# EAGLE design datalogger (EAGLE 7.6.0)
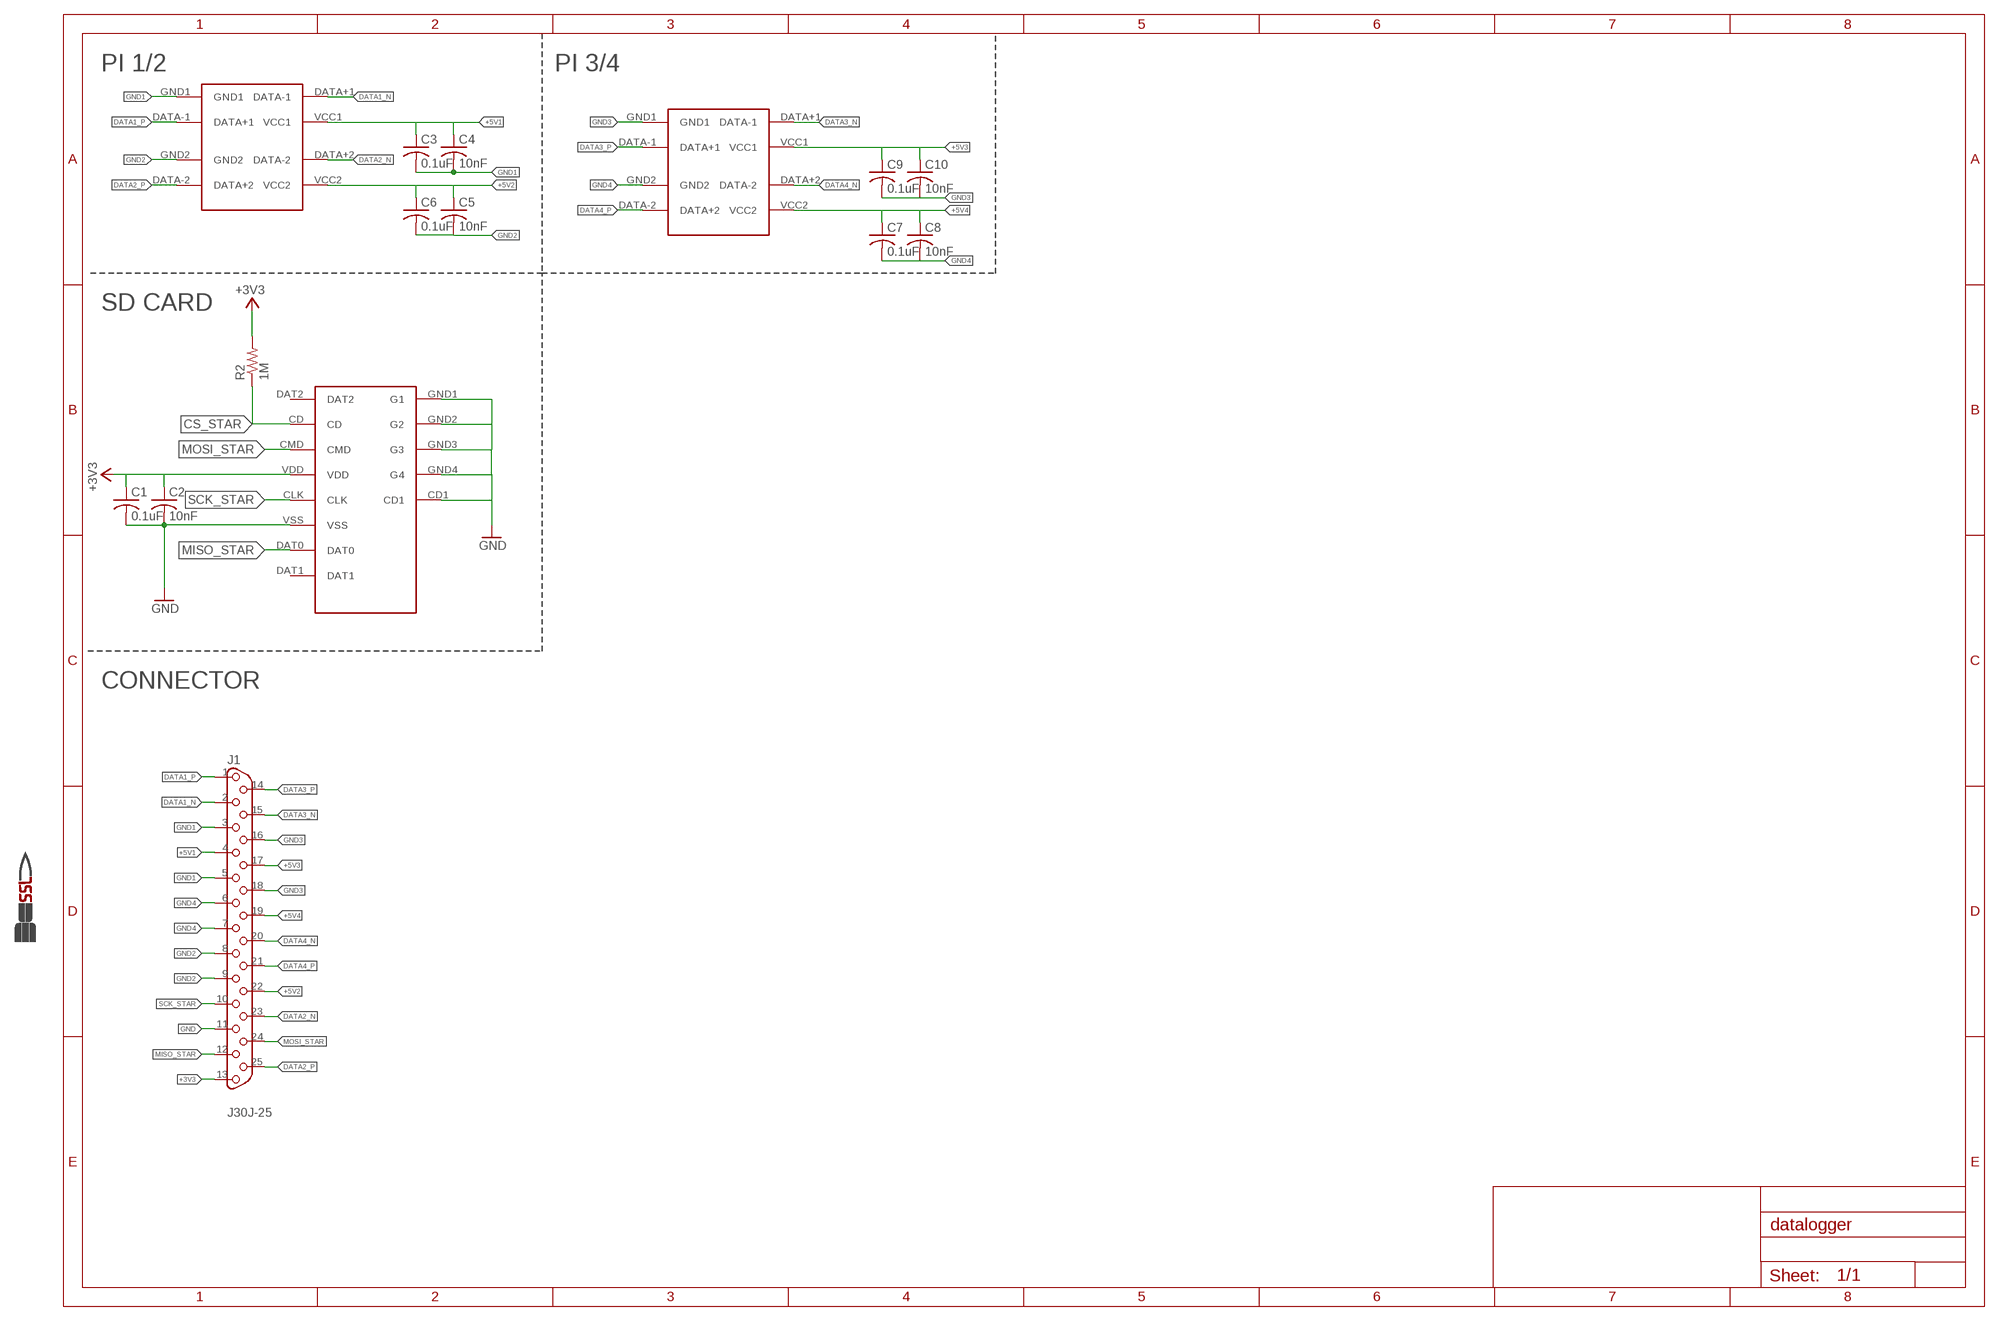
[diagram p0: schematic, sheet 1]

## Parts
C1  0.1uF  C-USC0603  [C0603]
C2  10nF  C-USC0603  [C0603]
C3  0.1uF  C-USC0603  [C0603]
C4  10nF  C-USC0603  [C0603]
C5  10nF  C-USC0603  [C0603]
C6  0.1uF  C-USC0603  [C0603]
C7  0.1uF  C-USC0603  [C0603]
C8  10nF  C-USC0603  [C0603]
C9  0.1uF  C-USC0603  [C0603]
C10  10nF  C-USC0603  [C0603]
GND1  SSL.3IN_SILK  [SSL_SILK_.3IN]
J1  J30J-25  [ZKN-25]
R2  1M  R-US_R0603  [R0603]
U$1  MICRO_SD  [MICRO_SD_HINGED]
U$2  USB_A  [USB_A]
U$3  USB_A  [USB_A]

## Nets
+3V3: C1.1 C2.1 J1.13 R2.2 U$1.VDD
+5V1: C3.1 C4.1 J1.4 U$2.VCC1
+5V2: C5.1 C6.1 J1.22 U$2.VCC2
+5V3: C9.1 C10.1 J1.17 U$3.VCC1
+5V4: C7.1 C8.1 J1.19 U$3.VCC2
CS_STAR: R2.1 U$1.CD
DATA1_N [diff_pair]: J1.2 U$2.DATA+1(DATA-1)
DATA1_P [diff_pair]: J1.1 U$2.DATA-1(DATA+1)
DATA2_N [diff_pair]: J1.23 U$2.DATA+2(DATA-2)
DATA2_P [diff_pair]: J1.25 U$2.DATA-2(DATA+2)
DATA3_N [diff_pair]: J1.15 U$3.DATA+1(DATA-1)
DATA3_P [diff_pair]: J1.14 U$3.DATA-1(DATA+1)
DATA4_N [diff_pair]: J1.20 U$3.DATA+2(DATA-2)
DATA4_P [diff_pair]: J1.21 U$3.DATA-2(DATA+2)
GND: C1.2 C2.2 J1.11 U$1.CD1 U$1.GND1(G1) U$1.GND2(G2) U$1.GND3(G3) U$1.GND4(G4) U$1.VSS
GND1: C3.2 C4.2 J1.3 J1.5 U$2.GND1
GND2: C5.2 C6.2 J1.8 J1.9 U$2.GND2
GND3: C9.2 C10.2 J1.16 J1.18 U$3.GND1
GND4: C7.2 C8.2 J1.6 J1.7 U$3.GND2
MISO_STAR: J1.12 U$1.DAT0
MOSI_STAR: J1.24 U$1.CMD
SCK_STAR: J1.10 U$1.CLK
Unconnected: U$1.DAT1 U$1.DAT2

## Notes on the sheet
- PI 1/2 | PI 3/4
- SD CARD
- CONNECTOR

## Library data of the parts
C1-C10 = resistor:C-US: CAPACITOR, American symbol
GND1 = images:SSL
J1 = CM_J30J:J30J-25
R2 = resistor:R-US_: RESISTOR, American symbol
U$1 = NR_connectors:MICRO_SD
U$2 U$3 = NR_connectors:USB_A

## Net classes
0 default: width 0.406 mm
1 diff_pair: width 0.737 mm

## Board
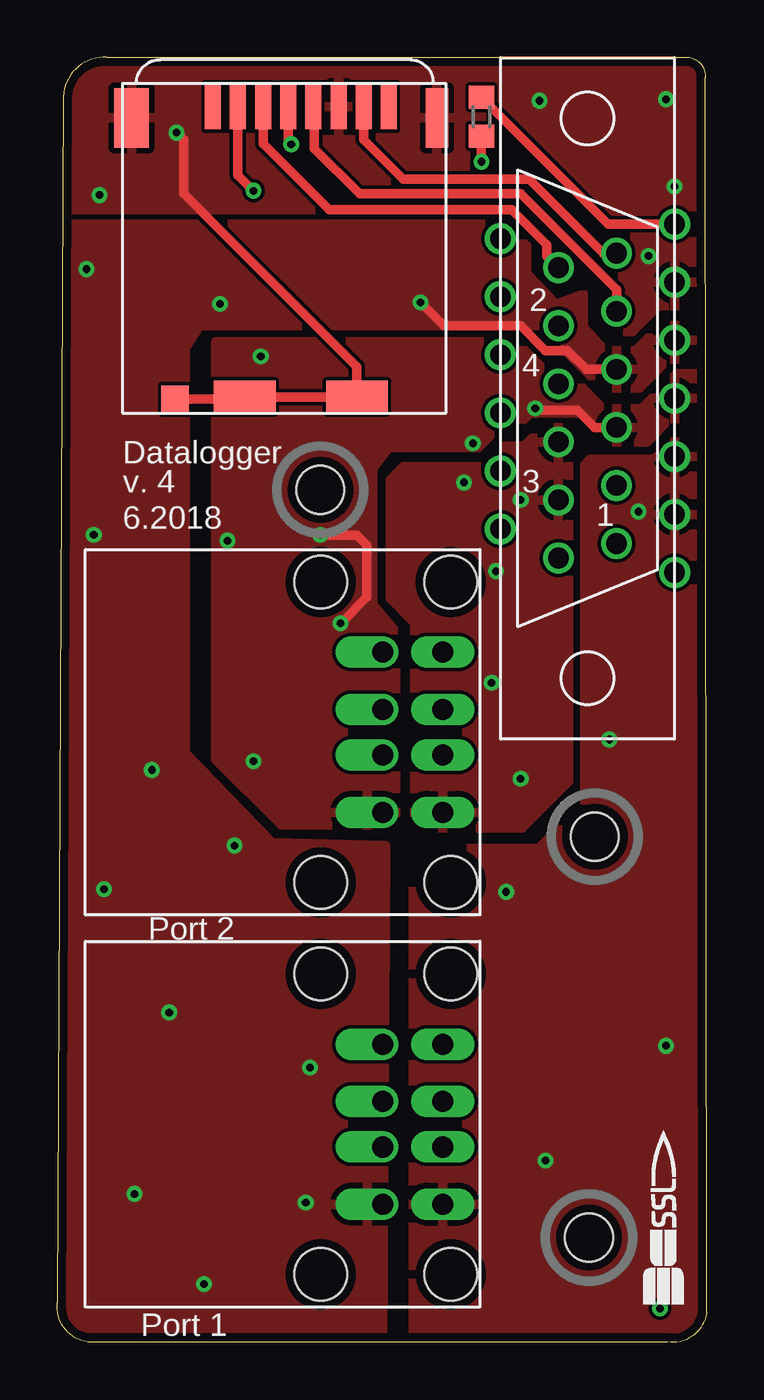
[diagram p1: board, top side]
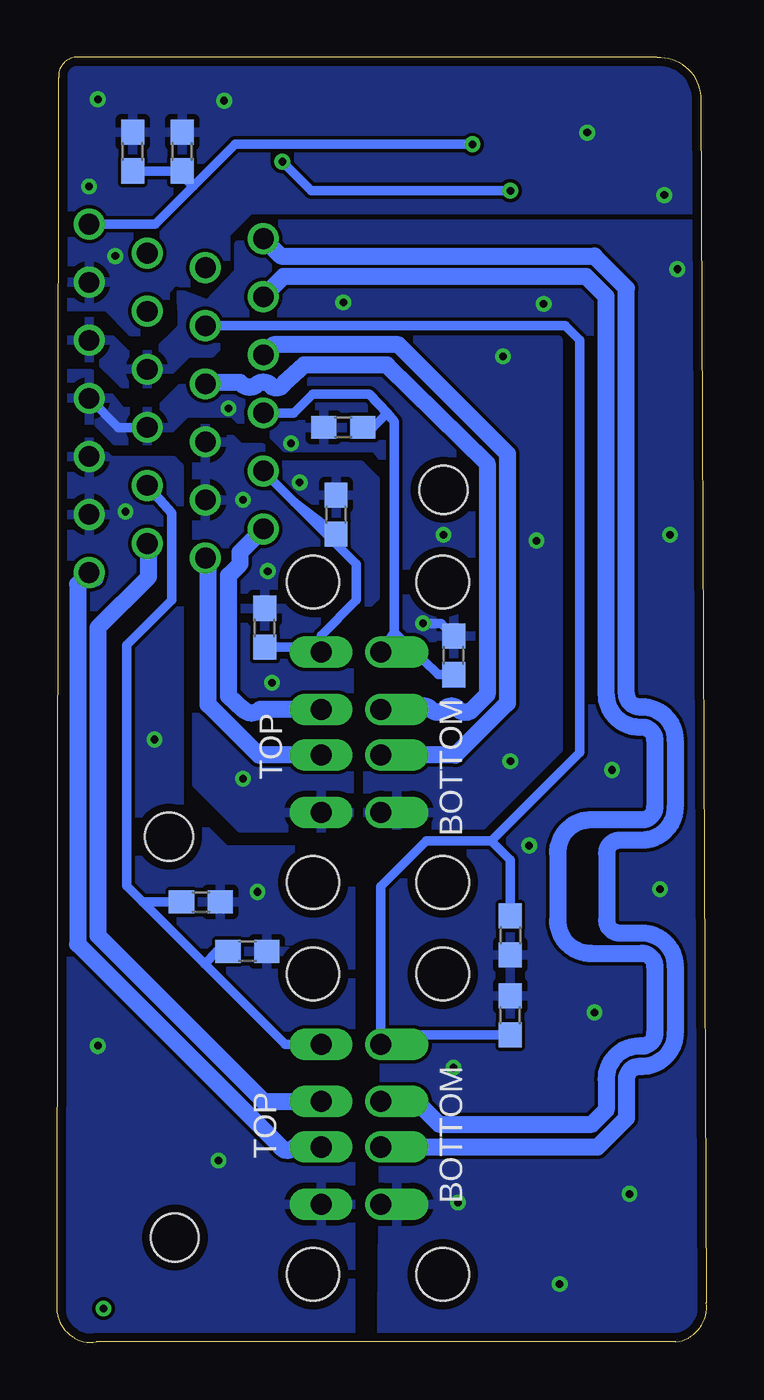
[diagram p2: board, bottom side, seen from below]

Size 28.4 x 56.21 mm. Coordinates in mm from the lower left corner, seen from the top.
Outline: 1.34,0.02 26.68,0.02 arc90 28.4,1.29 28.33,55.32 arc90 27.57,56.21 2.17,56.21 arc90 0.27,54.5 0.01,1.73 arc90 1.34,0.02
Copper layers (1*16): Top 0.0356mm / dielectric 1.5011mm / Bottom 0.0356mm
Design rules "OshPark": minimum track width 6mil, minimum drill 13mil, track to track 6mil, track to pad 6mil, pad to pad 6mil, via to via 6mil, smd to smd 6mil, copper to edge 15mil, drill to drill 6mil, minimum pad ring 7mil, minimum via ring 7mil, stop-mask expansion 3mil, vias tented up to drill 0mil, thermal gap 10mil
Holes 2.1 mm at 23.51,22.11 23.25,4.59 11.5,37.29

### Footprints (pad centres in the part's own frame; a part is rotated, then mirrored left to right if it is on the bottom)
C0603 = smd 1.1 x 1: 1 -0.85,0; 2 0.85,0
ZKN-25 = drill 0.9: 1 -7.62,-3.81; 2 -6.35,-1.27; 3 -5.08,-3.81; 4 -3.81,-1.27; 5 -2.54,-3.81; 6 -1.27,-1.27; 7 0,-3.81; 8 1.27,-1.27; 9 2.54,-3.81; 10 3.81,-1.27; 11 5.08,-3.81; 12 6.35,-1.27; 13 7.62,-3.81; 14 -6.985,1.27; 15 -5.715,3.81; 16 -4.445,1.27; 17 -3.175,3.81; 18 -1.905,1.27; 19 -0.635,3.81; 20 0.635,1.27; 21 1.905,3.81; 22 3.175,1.27; 23 4.445,3.81; 24 5.715,1.27; 25 6.985,3.81
R0603 = smd 1 x 1.1: 1 -0.85,0; 2 0.85,0
MICRO_SD_HINGED = smd 0.7 x 2: CD -1.1,-13.4; CLK -4.4,-13.4; CMD -2.2,-13.4; DAT0 -6.6,-13.4; DAT1 -7.7,-13.4; DAT2 0,-13.4; VDD -3.3,-13.4; VSS -5.5,-13.4 | smd 2.7 x 1.4: CD1 -1.4,-0.7; GND3 -6.3,-0.7 | smd 1.5 x 2.6: GND1 3.55,-12.9 | smd 1.2 x 1.2: GND2 1.65,-0.6 | smd 1 x 2.6: GND4 -9.8,-12.9
USB_A = drill 0.92 long: DATA+1 -1,7.005; DATA-1 1,7.005; GND1 3.5,7.005; VCC1 -3.5,7.005 | drill 0.92 offset: DATA+2 -1,4.385; DATA-2 1,4.385; GND2 3.5,4.385; VCC2 -3.5,4.385 | hole 2.3: -6.57,7.355; -6.57,1.675; 6.57,7.355; 6.57,1.675

### Placement (x,y rotation side)
C1  22.93,52.09 90 bottom
C2  25.09,52.09 90 bottom
C3  22.11,19.26 0 bottom
C4  20.08,17.1 0 bottom
C5  8.58,14.3 90 bottom
C6  8.58,17.8 270 bottom
C7  11.06,30.05 90 bottom
C8  15.89,40.02 180 bottom
C9  19.32,31.26 90 bottom
C10  16.2,36.21 90 bottom
GND1  25.28,1.67 0 top
J1  23.19,41.29 90 top
R2  18.55,53.61 90 top
U$1  6.81,40.66 180 top
U$2  9.85,9.54 270 top
U$3  9.85,26.69 270 top

### Tracks (layer width: path | path; a pad name or v marks a point on that pad's centre or on a via)
+3V3  (via drill 0.33)
  Top 0.406: J1.13 24.1,48.91 R2.2 | U$1.VDD 10.11,52.53 v10.23,52.4
  Bottom 0.406: v10.23,52.4 20.61,52.4 22.44,50.57 | 22.44,50.57 24.1,48.91 J1.13 | 22.44,50.57 22.93,51.07 C1.1 C2.1
+5V1
  Bottom 0.406: U$2.VCC1 18.43,13.04 21.95,16.56 | 21.95,16.56 24.65,19.26 | J1.4 23.38,36.27 23.38,32.46 25.35,30.5 25.35,19.95 24.65,19.26 | C3.1 24.65,19.26 | C4.1 21.41,17.1 21.95,16.56
+5V2
  Bottom 0.406: 9.41,21.92 12.27,21.92 14.24,19.95 U$2.VCC2 13.83,13.45 C5.1 | 9.41,21.92 5.54,25.8 5.54,43.83 6.17,44.47 J1.22 | C6.1 8.58,21.1 9.41,21.92
+5V3
  Bottom 0.406: 18.02,36.76 15.31,34.05 15.31,32.46 16.86,30.92 U$3.VCC1 17.08,30.41 C9.1 | 18.02,36.76 J1.17 | C10.1 18.02,36.76
+5V4
  Bottom 0.406: J1.19 18.04,40.66 17.22,41.48 14.74,41.48 13.97,40.64 | 13.66,31.08 U$3.VCC2 | C8.1 14.59,40.02 13.97,40.64 | 13.66,31.08 11.72,29.2 C7.1 | 13.66,31.08 13.66,40.28 13.97,40.64
CS_STAR  (via drill 0.33)
  Top 0.406: U$1.CD 7.91,51.05 v8.58,50.37 | v18.55,51.64 R2.1
  Bottom 0.406: v8.58,50.37 17.28,50.37 v18.55,51.64
DATA1_N
  Bottom 0.737: U$2.DATA+1 19.37,10.54 26.62,17.79 26.62,31.26 24.39,33.48 24.39,34.88 J1.2
DATA1_P
  Bottom 0.737: 26.74,33.42 J1.1 27.51,33.16 27.51,17.42 18.63,8.54 arc-97 18.04,8.52 16.87,8.52 arc-90 U$2.DATA-1
DATA2_N
  Bottom 0.737: J1.23 18.49,46.62 5.28,46.62 4.39,45.74 4.39,28.36 arc-90 2.94,26.91 2.83,26.91 arc90 2.27,26.35 2.27,23.41 arc90 2.83,22.85 5.07,22.85 arc-90 6.52,21.4 6.52,18.46 arc-90 5.07,17.02 2.83,17.02 arc90 2.27,16.46 2.27,13.52 arc90 2.83,12.96 2.94,12.96 arc-90 4.39,11.51 4.39,10.17 5.02,9.54 11.69,9.54 12.65,10.49 14.19,10.49 U$2.DATA+2
DATA2_P
  Bottom 0.737: U$2.DATA-2 4.76,8.54 3.5,9.8 3.5,11.51 arc90 2.94,12.07 2.83,12.07 arc-90 1.38,13.52 1.38,16.46 arc-90 2.83,17.9 3.81,17.9 arc90 4.37,18.46 4.37,21.4 arc90 3.81,21.96 2.83,21.96 arc-90 1.38,23.41 1.38,26.35 arc-90 2.83,27.8 2.94,27.8 arc90 3.5,28.36 3.5,46.11 4.91,47.51 18.62,47.51 J1.25
DATA3_N
  Bottom 0.737: J1.15 20.39,34.56 20.39,34.05 20.9,33.54 20.9,28.27 20.26,27.69 arc-92 19.51,27.7 16.87,27.7 arc90 U$3.DATA+1
DATA3_P
  Bottom 0.737: U$3.DATA-1 19.58,25.69 21.79,27.9 21.79,34.18 J1.14
DATA4_N
  Bottom 0.737: U$3.DATA+2 arc98 13.22,27.7 arc-96 12.65,27.7 arc96 12.08,27.7 arc-96 11.44,27.7 arc96 10.87,27.7 arc-93 10.24,27.69 9.6,28.33 9.6,38.44 13.97,42.75 17.6,42.75 18.49,41.93 arc86 19,41.8 arc-86 19.63,41.93 arc98 20.39,41.99 21.77,41.99 arc-45 J1.20
DATA4_P
  Bottom 0.737: U$3.DATA-2 10.99,25.69 8.71,27.96 8.71,38.87 13.48,43.64 18.93,43.64 J1.21
GND  (via drill 0.33)
  Top 0.406: v5.22,52.91 5.54,52.59 5.54,50.24 13.11,42.67 U$1.GND3 13.04,41.42 12.9,41.42 12.84,41.36 U$1.CD1 8.11,41.26 U$1.GND2
  other vias: 1.85,50.18 21.09,54.31 26.62,54.37 27,50.56 25.86,47.51
  pour Top (rank 3): 29.09,45.35 26.3,45.35 25.16,44.21 24.01,44.21 23.44,44.78 23.7,45.99 23.25,46.43 22.17,46.05 21.03,47.2 21.03,48.47 19.95,49.55 -0.75,49.55 -0.75,57.23 29.09,57.23
  pour Bottom (rank 3): 26.24,45.29 25.16,44.21 24.01,44.21 23.44,44.78 23.7,45.99 23.25,46.43 22.11,46.05 21.03,47.13 21.03,48.47 19.95,49.55 -2.08,49.55 -2.08,56.4 29.35,56.4 29.35,45.29
GND1  (via drill 0.33)
  other vias: 25.41,36.34 24.14,26.37 19.63,19.7 26.62,12.97 21.35,7.95
  pour Bottom (rank 2): 29.6,39.39 26.87,39.39 26.05,38.56 23.32,38.56 23.06,38.31 23.06,23.57 21.03,21.54 15.57,21.54 15.57,-0.43 29.98,-0.43 29.98,39.39 29.73,39.39
  pour Top (rank 2): 29.22,39.39 26.87,39.39 26.36,38.88 26.11,38.62 23.32,38.62 23.06,38.37 23.06,23.64 21.03,21.61 15.57,21.61 15.57,-1.51 29.22,-1.51
GND2  (via drill 0.33)
  Top 0.406: J1.8 23.12,42.56 22.3,43.39 21.35,43.39 20.27,44.47 16.9,44.47 v15.89,45.48
  other vias: 7.12,45.42 1.28,46.94 1.6,35.32 4.14,25.03 7.76,21.73 4.9,14.43 2.04,19.83 11.06,12.02 3.38,6.49 6.42,2.56 10.87,6.11
  pour Bottom (rank 2): 29.22,44.66 26.81,44.66 25.35,43.2 24.14,43.2 22.93,44.4 22.93,45.04 23,45.86 21.79,45.42 20.46,46.81 20.46,48.02 19.57,48.91 -2.15,48.91 -2.15,-0.87 14.24,-0.87 13.98,21.8 9.35,21.92 5.54,25.8 5.6,43.89 6.11,44.4 20.52,44.4 21.66,43.26 22.68,43.26 24.01,41.93 25.54,41.93 26.68,43.07 29.28,43.07 29.28,44.72
  pour Top (rank 2): 28.9,44.47 26.36,44.47 25.28,43.39 23.95,43.39 23,44.4 23,45.86 21.79,45.42 20.52,46.75 20.52,47.96 19.57,48.91 -2.78,48.91 -2.78,-0.37 14.24,-0.37 14.36,21.73 9.41,21.86 5.6,25.8 5.6,43.51 6.23,44.47 21.09,44.47 23.82,41.73 25.47,41.73 26.74,43 28.9,43
GND3  (via drill 0.33)
  other vias: 20.27,24.65 19,28.84 19.19,33.73 20.27,36.85 17.79,37.61
  pour Bottom (rank 2): 22.24,39.96 21.22,39.96 20.39,39.13 19.44,39.13 18.87,38.56 18.68,38.37 15.12,38.37 14.49,37.73 14.49,32.59 15.63,31.45 15.63,22.49 20.39,22.49 22.3,24.4 22.3,39.96
  pour Top (rank 2): 22.36,40.02 21.22,40.02 20.39,39.19 19.57,39.19 18.68,38.31 15.12,38.31 14.55,37.73 14.55,32.53 15.63,31.45 15.63,22.49 20.33,22.49 22.36,24.53
GND4  (via drill 0.33, 0.33 pad 0.33)
  Top 0.406: J1.6 23.51,40.02 22.74,40.78 20.97,40.78 v20.9,40.85 | v11.5,35.32 13.09,35.32 13.54,34.88 13.54,32.59 v12.39,31.45
  Bottom 0.406: J1.6 25.73,40.02 J1.7 | v12.39,31.45 11.61,31.45 C7.2
  other vias: 8.9,43.13 7.44,35.07 8.58,25.42 18.17,39.32
  pour Bottom (rank 2): 29.35,42.37 26.94,42.37 25.6,40.72 24.01,40.72 22.3,42.43 21.47,42.43 20.08,43.83 6.49,43.83 6.49,25.92 9.79,22.62 14.81,22.62 14.81,31.07 13.79,32.21 13.79,38.24 14.49,39.13 18.43,39.13 19.25,39.96 20.01,39.96 20.71,40.66 22.74,40.66 23.95,39.45 25.86,39.45 26.74,40.34 29.35,40.27
  pour Top (rank 2): 29.35,42.37 27.06,42.37 25.54,40.85 23.89,40.85 22.24,42.5 21.35,42.5 20.08,43.77 6.93,43.77 6.93,25.48 9.79,22.62 14.81,22.62 14.81,31.07 13.79,32.27 13.79,38.24 14.49,39.13 18.43,39.13 19.19,39.89 19.95,39.89 20.71,40.66 22.87,40.66 24.14,39.39 25.79,39.39 26.81,40.4 29.35,40.27
MISO_STAR
  Top 0.406: J1.12 23.89,47.64 20.65,50.88 15.12,50.88 13.41,52.59 U$1.DAT0
MOSI_STAR
  Top 0.406: U$1.CMD 9.01,52.43 11.89,49.55 19.89,49.55 21.41,48.02 21.41,47.51 J1.24
N$6  (via drill 0.33)
  other vias: 26.36,1.48
SCK_STAR
  Top 0.406: J1.10 24.46,46.05 20.27,50.24 13.22,50.24 11.25,52.21 11.25,54.01 U$1.CLK

### Text on the board
tPlace: 2 | 4 | Datalogger | v. 4 | 3 | 6.2018 | 1 | Port 2 | Port 1
bPlace: BOTTOM | TOP | BOTTOM | TOP